# EAGLE schematic Arm (EAGLE 9.6.2)
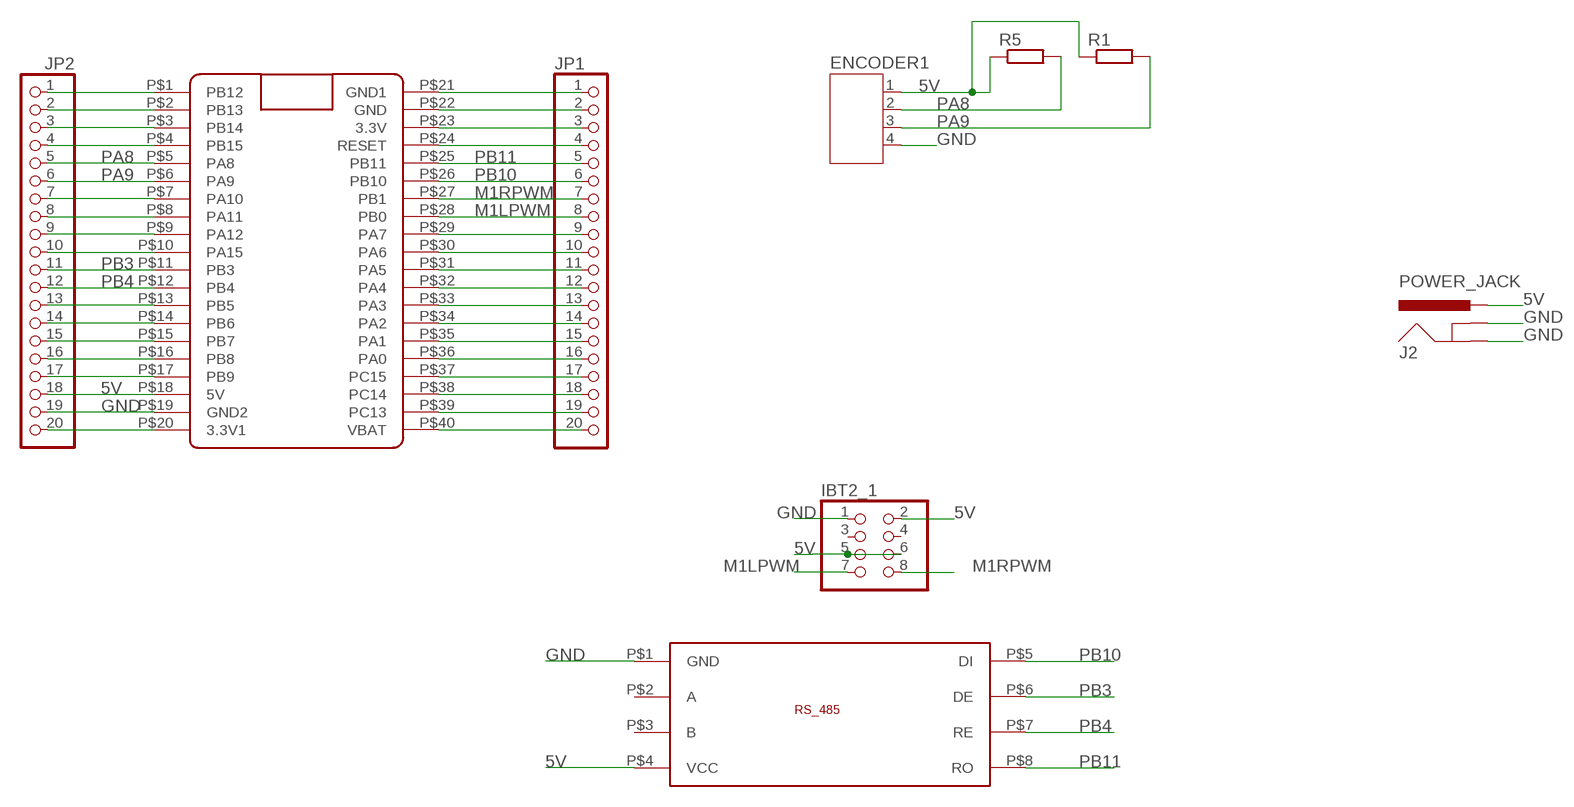
[diagram p0: schematic, sheet 1]

## Parts
ENCODER1  JST-PH4  [JST-PH4]
IBT2_1  PINHD-2X4  [2X04]
J2  POWER_JACK  [POWER_JACK]
JP1  PINHD-1X20  [1X20]
JP2  PINHD-1X20  [1X20]
R1  R-EU_0207/10  [0207/10]
R5  R-EU_0207/10  [0207/10]
U$1  BLUE_PILL  [BLUE_PILL]
U$2  RS_485PCB  [RSS485PCB]

## Nets
5V: ENCODER1.1 IBT2_1.2 IBT2_1.5 IBT2_1.6 J2.PWR JP2.18 R1.1 R5.1 U$1.P$18(5V) U$2.P$4(VCC)
GND: ENCODER1.4 IBT2_1.1 J2.GNDBREAK JP2.19 U$1.P$19(GND2) U$2.P$1(GND)
M1LPWM: IBT2_1.7 JP1.8 U$1.P$28(PB0)
M1RPWM: IBT2_1.8 JP1.7 U$1.P$27(PB1)
N$1: JP1.1 U$1.P$21(GND1)
N$2: JP1.2 U$1.P$22(GND)
N$3: JP1.3 U$1.P$23(3.3V)
N$4: JP1.4 U$1.P$24(RESET)
N$5: JP1.9 U$1.P$29(PA7)
N$6: J2.GND
N$7: JP1.10 U$1.P$30(PA6)
N$8: JP2.14 U$1.P$14(PB6)
N$9: JP2.15 U$1.P$15(PB7)
N$11: JP1.11 U$1.P$31(PA5)
N$12: JP1.12 U$1.P$32(PA4)
N$13: JP1.13 U$1.P$33(PA3)
N$14: JP1.14 U$1.P$34(PA2)
N$15: JP1.15 U$1.P$35(PA1)
N$16: JP1.16 U$1.P$36(PA0)
N$17: JP1.17 U$1.P$37(PC15)
N$18: JP1.18 U$1.P$38(PC14)
N$19: JP1.19 U$1.P$39(PC13)
N$20: JP1.20 U$1.P$40(VBAT)
N$21: JP2.1 U$1.P$1(PB12)
N$22: JP2.2 U$1.P$2(PB13)
N$23: JP2.3 U$1.P$3(PB14)
N$24: JP2.4 U$1.P$4(PB15)
N$27: JP2.7 U$1.P$7(PA10)
N$28: JP2.8 U$1.P$8(PA11)
N$29: JP2.9 U$1.P$9(PA12)
N$30: JP2.10 U$1.P$10(PA15)
N$33: JP2.13 U$1.P$13(PB5)
N$36: JP2.16 U$1.P$16(PB8)
N$37: JP2.17 U$1.P$17(PB9)
N$40: JP2.20 U$1.P$20(3.3V1)
PA8: ENCODER1.2 JP2.5 R5.2 U$1.P$5(PA8)
PA9: ENCODER1.3 JP2.6 R1.2 U$1.P$6(PA9)
PB3: JP2.11 U$1.P$11(PB3) U$2.P$6(DE)
PB4: JP2.12 U$1.P$12(PB4) U$2.P$7(RE)
PB10: JP1.6 U$1.P$26(PB10) U$2.P$5(DI)
PB11: JP1.5 U$1.P$25(PB11) U$2.P$8(RO)
Unconnected: IBT2_1.3 IBT2_1.4 U$2.P$2(A) U$2.P$3(B)

## Library data of the parts
ENCODER1 = jst-ph:JST-PH4
IBT2_1 = pinhead:PINHD-2X4: PIN HEADER
J2 = J-Generic-5.5mm-Barrel-Jack:POWER_JACK: Power Jack Connector This is the standard 5.5mm barrel jack for power. The PTH is the most common, proven, reliable, footprint. The Slot footprint only works if the mill layer is transmitted to the PCB fab house so be warned. Here are the connectors we sell at SparkFun: DC Barrel Power Jack/Connector <https://www.sparkfun.com/products/119> (PRT-00119) DC Barrel Power Jack/Connector (SMD) <https://www.sparkfun.com/products/12748> (PRT-12748) DC Barrel Jack Adapter - Breadboard Compatible <https://www.sparkfun.com/products/10811> (PRT-10811) It is used on this SparkFun product (and many, many others): SparkFun RedBoard - Programmed with Arduino <https://www.sparkfun.com/products/12757> (DEV-12757) Also, if you need a mating power supply or connector, please check these out: Wall Adapter Power Supply - 9VDC 650mA <https://www.sparkfun.com/products/298> (TOL-00298) DC Barrel Jack Adapter - Male <https://www.sparkfun.com/products/10287> (PRT-10287); DPN: CP-202A-ND; MPN: PJ-202A
JP1 JP2 = pinhead:PINHD-1X20: PIN HEADER
R1 R5 = rcl:R-EU_: RESISTOR, European symbol; SPICEPREFIX: R
U$1 = BluePill:BLUE_PILL
U$2 = RS_485PCB:RS_485PCB

## Net classes
0 default: width 1.016 mm, clearance 0.508 mm